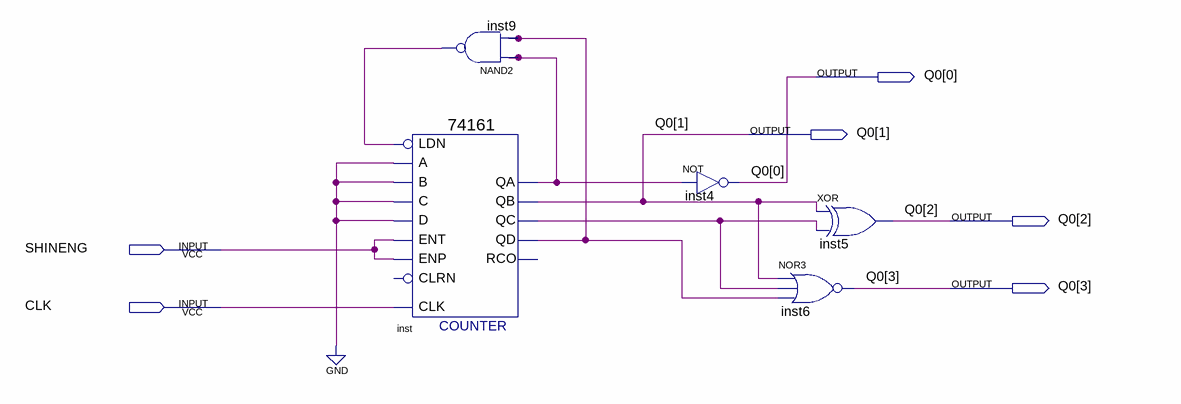
[diagram p0: schematic sheet]
// Quartus schematic yellow.bdf as structural Verilog: 5 symbols, 6 pins
module yellow (
  input  SHINENG,
  input  CLK,
  output [3:0] Q0
);

  wire inst9_out, inst_qa, inst_qc, inst_qd;

  \74161  inst (
    .CLK(CLK), .ENP(SHINENG), .LDN(inst9_out), .A(1'b0), .D(1'b0), .ENT(SHINENG), .B(1'b0), .C(1'b0),
    .QD(inst_qd), .QC(inst_qc), .QB(Q0[1]), .QA(inst_qa));  // open: CLRN, RCO
  nand inst9 (inst9_out, inst_qa, inst_qd);
  not inst4 (Q0[0], inst_qa);
  nor inst6 (Q0[3], Q0[1], inst_qc, inst_qd);
  xor inst5 (Q0[2], Q0[1], inst_qc);
endmodule
